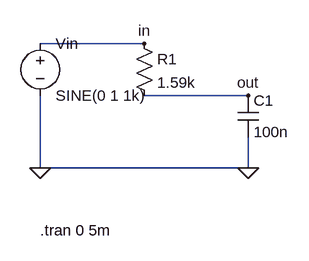
[diagram p0: schematic rc_lowpass.asc]
rc_lowpass.asc, the LTspice schematic file:
Version 4
SHEET 1 880 680
WIRE 80 160 240 160
WIRE 240 240 400 240
WIRE 80 240 80 352
WIRE 400 304 400 352
WIRE 80 352 400 352
FLAG 80 352 0
FLAG 400 352 0
FLAG 240 160 in
FLAG 400 240 out
SYMBOL voltage 80 144 R0
SYMATTR InstName Vin
SYMATTR Value SINE(0 1 1k)
SYMBOL res 224 144 R0
SYMATTR InstName R1
SYMATTR Value 1.59k
SYMBOL cap 384 240 R0
SYMATTR InstName C1
SYMATTR Value 100n
TEXT 80 448 Left 2 !.tran 0 5m
* End of ltspice-ai-agent output

The netlist it stands for:
* rc_lowpass.asc
Vin in 0 SINE(0 1 1k)
R1 in out 1.59k
C1 out 0 100n
.tran 0 5m
.backanno
.end